# EAGLE design Agit POVera rev 5 (EAGLE 7.2.0)
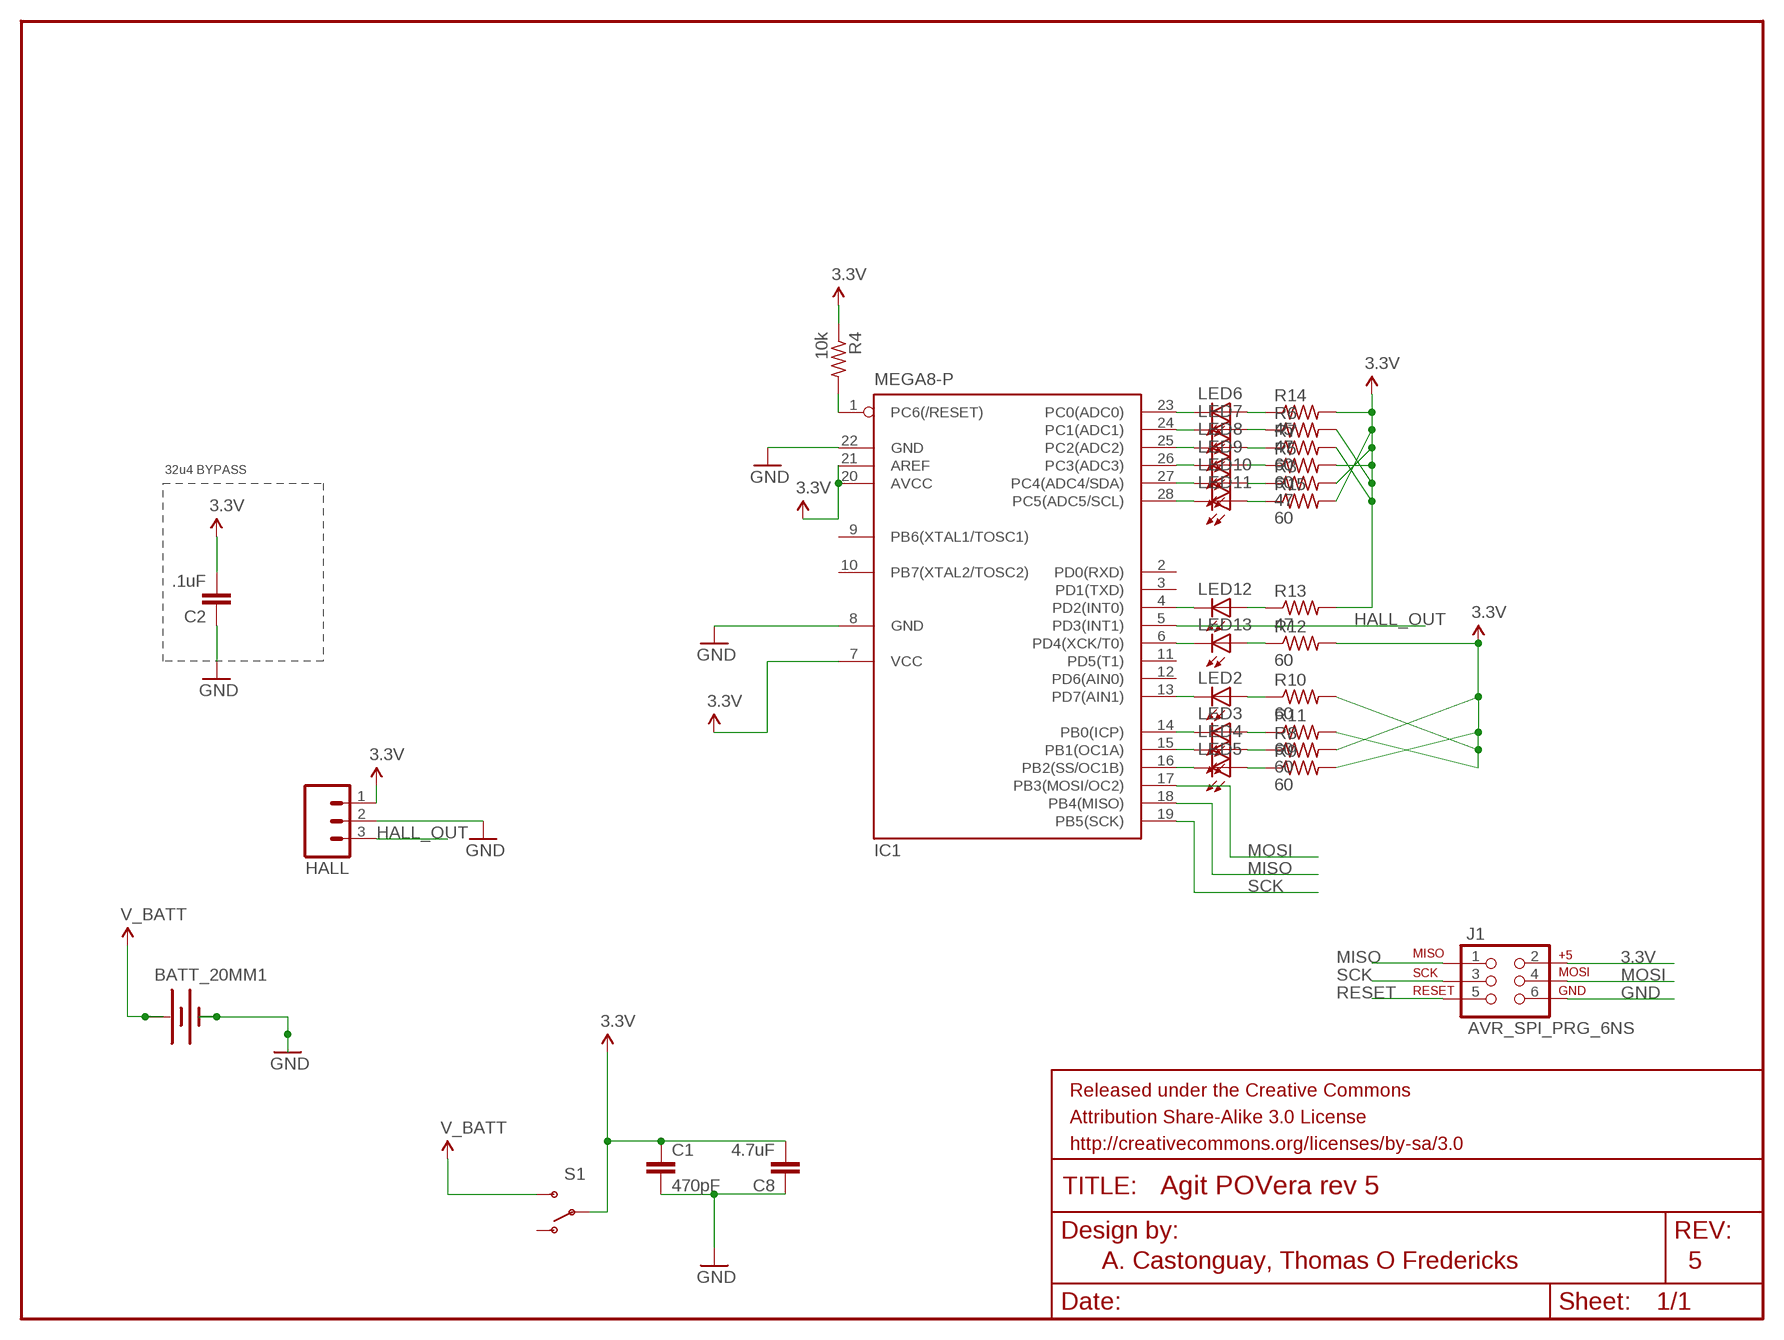
[diagram p0: schematic, sheet 1]

## Parts
BATT_20MM1  BATTERIE  [BATTERIE]
C1  470pF  CAPEZ  [CAP-PTH-SMALLEZ]
C2  .1uF  CAPEZ  [CAP-PTH-SMALLEZ]
C8  4.7uF  CAPEZ  [CAP-PTH-SMALLEZ]
HALL  M03PTH  [1X03]
IC1  MEGA8-P  [DIL28-3]
J1  AVR_SPI_PRG_6NS  [2X3-NS]
LED2  LED5MM  [LED5MM]
LED3  LED5MM  [LED5MM]
LED4  LED5MM  [LED5MM]
LED5  LED5MM  [LED5MM]
LED6  LED5MM  [LED5MM]
LED7  LED5MM  [LED5MM]
LED8  LED5MM  [LED5MM]
LED9  LED5MM  [LED5MM]
LED10  LED5MM  [LED5MM]
LED11  LED5MM  [LED5MM]
LED12  LED5MM  [LED5MM]
LED13  LED5MM  [LED5MM]
R3  47  R-US_0204/7  [0204/7]
R4  10k  R-US_0204/7  [0204/7]
R5  60  R-US_0204/7  [0204/7]
R6  47  R-US_0204/7  [0204/7]
R7  60  R-US_0204/7  [0204/7]
R8  60  R-US_0204/7  [0204/7]
R9  60  R-US_0204/7  [0204/7]
R10  60  R-US_0204/7  [0204/7]
R11  60  R-US_0204/7  [0204/7]
R12  60  R-US_0204/7  [0204/7]
R13  47  R-US_0204/7  [0204/7]
R14  45  R-US_0204/7  [0204/7]
R15  60  R-US_0204/7  [0204/7]
S1  SWITCH-SPDTPTH  [SWITCH-SPDT]

## Nets
3.3V: C1.1 C2.2 C8.2 HALL.1 IC1.7(VCC) IC1.20(AVCC) IC1.21(AREF) J1.2 R3.2 R4.1 R5.2 R6.2 R7.2 R8.2 R9.2 R10.2 R11.2 R12.2 R13.2 R14.2 R15.2 S1.2(P)
GND: BATT_20MM1.2(-) C1.2 C2.1 C8.1 HALL.2 IC1.8(GND) IC1.22(GND) J1.6
HALL_OUT: HALL.3 IC1.5(PD3(INT1))
LED2: IC1.13(PD7(AIN1)) LED2.K(C)
LED3: IC1.14(PB0(ICP)) LED3.K(C)
LED4: IC1.15(PB1(OC1A)) LED4.K(C)
LED5: IC1.16(PB2(SS/OC1B)) LED5.K(C)
LED6: IC1.23(PC0(ADC0)) LED6.K(C)
LED7: IC1.24(PC1(ADC1)) LED7.K(C)
LED8: IC1.25(PC2(ADC2)) LED8.K(C)
LED9: IC1.26(PC3(ADC3)) LED9.K(C)
LED10: IC1.27(PC4(ADC4/SDA)) LED10.K(C)
LED11: IC1.28(PC5(ADC5/SCL)) LED11.K(C)
LED12: IC1.4(PD2(INT0)) LED12.K(C)
LED13: IC1.6(PD4(XCK/T0)) LED13.K(C)
MISO: IC1.18(PB4(MISO)) J1.1
MOSI: IC1.17(PB3(MOSI/OC2)) J1.4
N$14: LED7.A R6.1
N$15: LED12.A R13.1
N$16: LED13.A R12.1
N$17: LED3.A R11.1
N$18: LED2.A R10.1
N$19: LED5.A R9.1
N$20: LED4.A R8.1
N$22: LED10.A R3.1
N$23: LED11.A R15.1
N$25: LED6.A R14.1
R7: LED8.A R7.1
R9: LED9.A R5.1
RESET: IC1.1(PC6(/RESET)) J1.5 R4.2
SCK: IC1.19(PB5(SCK)) J1.3
V_BATT: BATT_20MM1.1(+) S1.3(S)
Unconnected: IC1.2(PD0(RXD)) IC1.3(PD1(TXD)) IC1.9(PB6(XTAL1/TOSC1)) IC1.10(PB7(XTAL2/TOSC2)) IC1.11(PD5(T1)) IC1.12(PD6(AIN0)) S1.1(O)

## Notes on the sheet
- 32u4 BYPASS
- A. Castonguay, Thomas O Fredericks | 5

## Library data of the parts
BATT_20MM1 = User-Submitted:BATTERIE
C1 = SparkFun-Passives:CAP: Capacitor Standard 0603 ceramic capacitor, and 0.1" leaded capacitor.; PROD_ID: CAP-07884
C2 = SparkFun-Passives:CAP: Capacitor Standard 0603 ceramic capacitor, and 0.1" leaded capacitor.; PROD_ID: CAP-00810
C8 = SparkFun-Passives:CAP: Capacitor Standard 0603 ceramic capacitor, and 0.1" leaded capacitor.; PROD_ID: CAP-10300
HALL = SparkFun-Connectors:M03: Header 3 Standard 3-pin 0.1" header. Use with straight break away headers (SKU : PRT-00116), right angle break away headers (PRT-00553), swiss pins (PRT-00743), machine pins (PRT-00117), and female headers (PRT-00115). Molex polarized connector foot print use with SKU : PRT-08232 with associated crimp pins and housings.
IC1 = atmel:MEGA8-P: MICROCONTROLLER 8 Kbytes FLASH, 1 kbytes SRAM, 512 bytes EEPROM, USART, 4-channel 10 bit ADC, 2-channel 8 bit ADC Pin compatible with Atmega48, ATMega88, ATMega168 Source: avr.lbr; OC_FARNELL: unknown; OC_NEWARK: unknown
J1 = SparkFun-Connectors:AVR_SPI_PRG_6: AVR ISP 6 Pin This is the reduced ISP connector for AVR programming. Common on Arduino. This footprint will take up less PCB space and can be used with a 10-pin to 6-pin adapter such as SKU: BOB-08508
LED2-LED13 = SparkFun-LED:LED: LEDs Standard schematic elements and footprints for 5mm, 3mm, 1206, and 0603 sized LEDs. 5mm - Spark Fun Electronics SKU : COM-00529 (and others)
R3-R15 = resistor:R-US_: RESISTOR, American symbol; PROD_ID: RES-00824
S1 = SparkFun-Electromechanical:SWITCH-SPDT: SPDT Switch Simple slide switch, Spark Fun Electronics SKU : COM-00102 DPDT SMT slide switch, AYZ0202, SWCH-08179

## Board
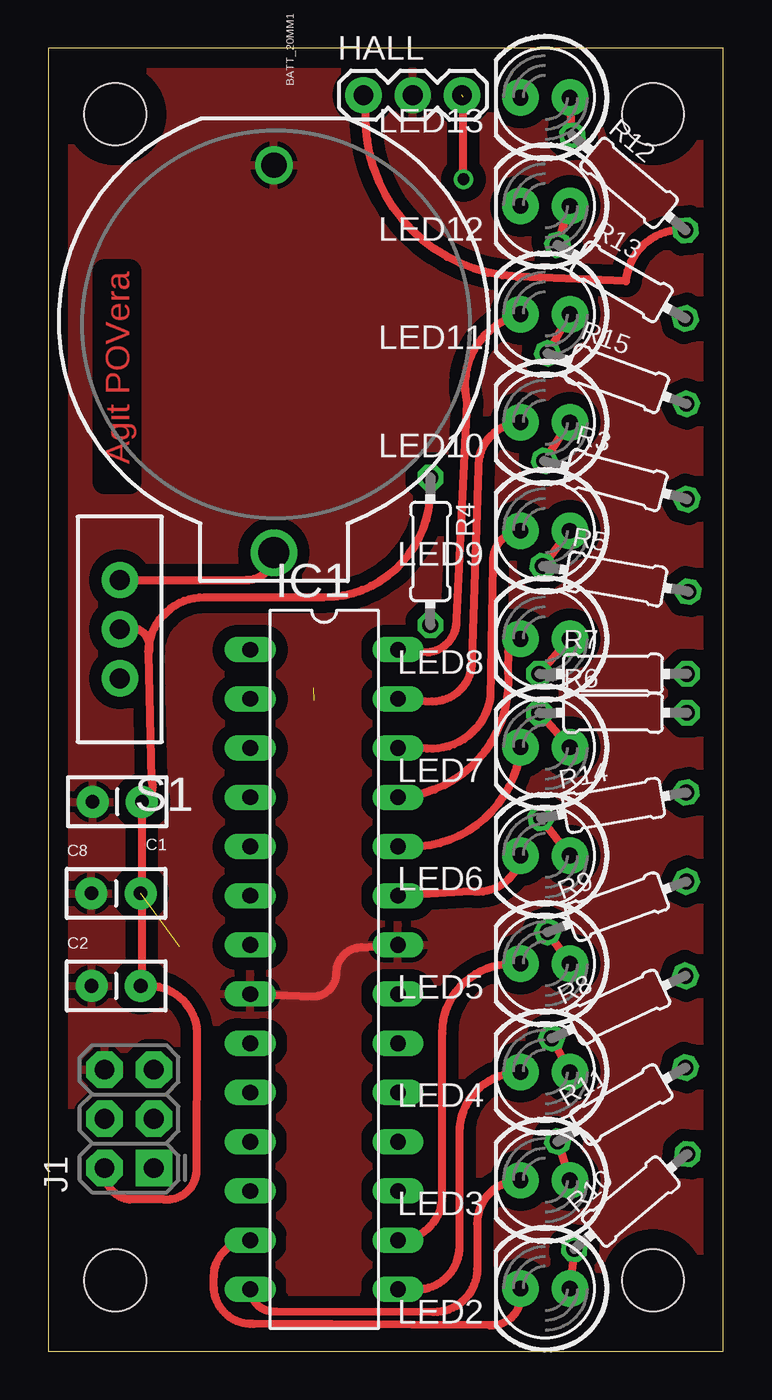
[diagram p1: board, top side]
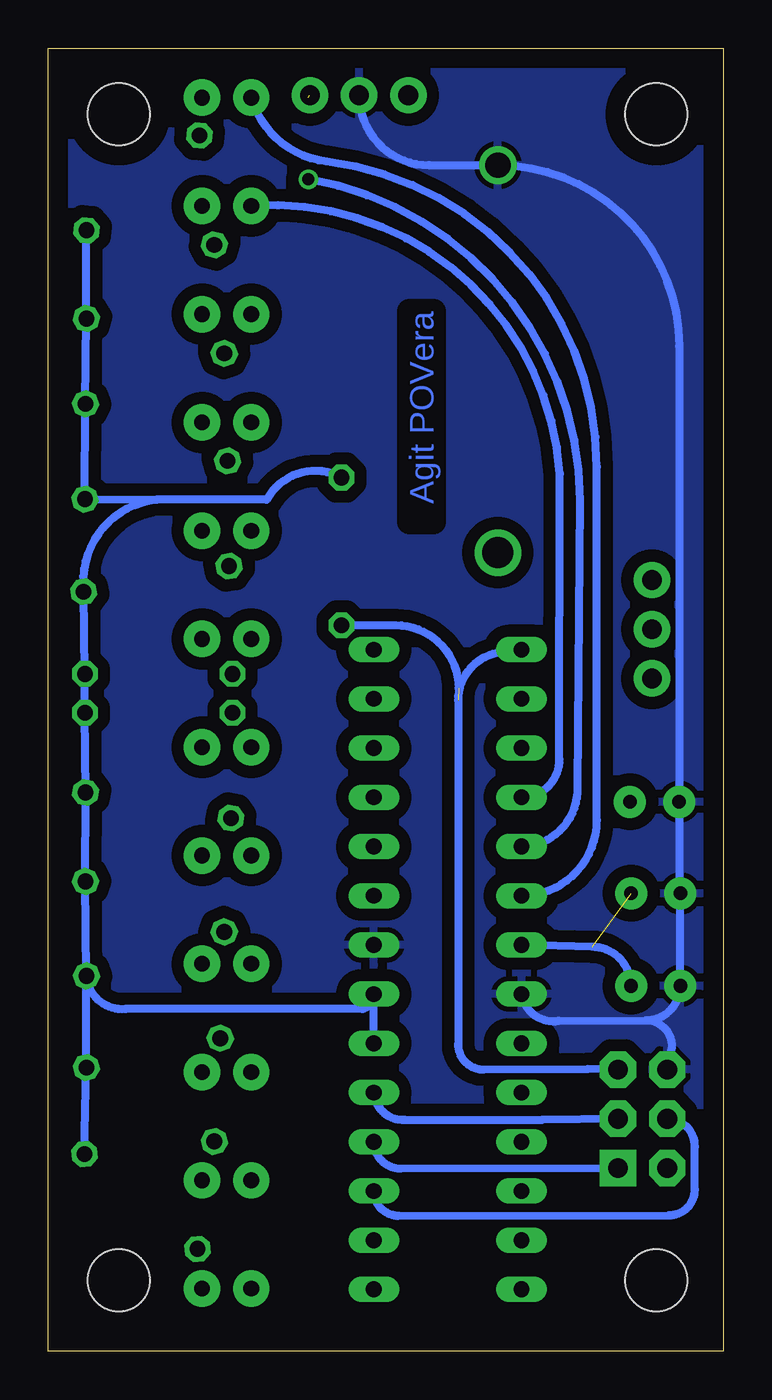
[diagram p2: board, bottom side, seen from below]

Size 34.82 x 67.23 mm. Coordinates in mm from the lower left corner, seen from the top.
Outline: 0,0 34.82,0 34.82,67.23 0,67.23 0,0
Copper layers (1*16): Top 0.035mm / dielectric 1.5mm / Bottom 0.035mm
Design rules "default *": minimum track width 16mil, minimum drill 24mil, track to track 8mil, track to pad 8mil, pad to pad 8mil, via to via 8mil, smd to smd 8mil, copper to edge 40mil, drill to drill 8mil, minimum pad ring 10mil, minimum via ring 8mil, stop-mask expansion 4mil, vias tented up to drill 0mil, thermal gap 10mil
Holes 3.2 mm at 3.45,63.83 31.19,63.83 3.45,3.66 31.19,3.66

### Footprints (pad centres in the part's own frame; a part is rotated, then mirrored left to right if it is on the bottom)
BATTERIE = drill 1.6: 1 11.85,0 | drill 1.3: 2 -8.15,0
CAP-PTH-SMALLEZ = drill 0.7 pad 1.651: 1 0,0; 2 2.54,0
1X03 = drill 1.016 pad 1.88: 1 0,0; 2 2.54,0; 3 5.08,0
DIL28-3 = drill 0.813 long: 1 -16.51,-3.81; 2 -13.97,-3.81; 3 -11.43,-3.81; 4 -8.89,-3.81; 5 -6.35,-3.81; 6 -3.81,-3.81; 7 -1.27,-3.81; 8 1.27,-3.81; 9 3.81,-3.81; 10 6.35,-3.81; 11 8.89,-3.81; 12 11.43,-3.81; 13 13.97,-3.81; 14 16.51,-3.81; 15 16.51,3.81; 16 13.97,3.81; 17 11.43,3.81; 18 8.89,3.81; 19 6.35,3.81; 20 3.81,3.81; 21 1.27,3.81; 22 -1.27,3.81; 23 -3.81,3.81; 24 -6.35,3.81; 25 -8.89,3.81; 26 -11.43,3.81; 27 -13.97,3.81; 28 -16.51,3.81
2X3-NS = drill 1.016 pad 1.88 square: 1 -2.54,-1.27 | drill 1.016 pad 1.88 octagon: 2 -2.54,1.27; 3 0,-1.27; 4 0,1.27; 5 2.54,-1.27; 6 2.54,1.27
LED5MM = drill 0.813 pad 1.88: A -1.27,0; K 1.27,0
0204/7 = drill 0.813 octagon: 1 -3.81,0; 2 3.81,0
SWITCH-SPDT = drill 1.016 pad 1.88: 1 0,2.54; 2 0,0; 3 0,-2.54

### Placement (x,y rotation side)
BATT_20MM1  11.63,53.06 270 top
C1  4.82,28.35 180 top
C2  2.22,18.85 0 top
C8  2.22,23.63 0 top
HALL  16.26,64.82 0 top
IC1  14.22,19.69 270 top
J1  4.17,11.99 90 top
LED2  25.63,3.23 180 top
LED3  25.63,8.81 180 top
LED4  25.63,14.4 180 top
LED5  25.63,19.99 180 top
LED6  25.63,25.58 180 top
LED7  25.63,31.17 180 top
LED8  25.63,36.75 180 top
LED9  25.63,42.34 180 top
LED10  25.63,47.93 180 top
LED11  25.63,53.52 180 top
LED12  25.63,59.11 180 top
LED13  25.63,64.69 180 top
R3  29.26,44.96 345 top
R4  19.7,41.27 270 top
R5  29.26,39.85 350 top
R6  29.13,32.94 0 top
R7  29.13,34.95 0 top
R8  29.41,17.75 25 top
R9  29.34,22.94 20 top
R10  30.05,7.72 40 top
R11  29.57,12.73 30 top
R12  29.95,60.3 320 top
R13  29.57,55.19 330 top
R14  29.16,28.17 10 top
R15  29.34,50.19 340 top
S1  3.68,37.26 180 top

### Tracks (layer width: path | path; a pad name or v marks a point on that pad's centre or on a via)
3.3V  (1 unrouted)
  Top 0.406: R12.2 arc90 29.79,55.22 24.18,55.45 arc-90 16.38,64.03 HALL.1 | J1.2 arc90 4.19,7.82 5.97,7.82 arc90 7.62,9.17 7.64,16.68 arc90 C2.2 arc90 4.82,18.9 C1.1 arc90 5.31,29.48 5.16,36.02 | S1.2 4.55,37.28 arc-90 5.16,36.02 | 5.16,36.02 arc-90 8.05,38.91 14.2,38.91 arc90 19.7,44.42 R4.1
  Bottom 0.406: IC1.20 IC1.21 arc70 18.61,17.65 30.86,17.65 arc90 R8.2 | R4.1 arc-90 23.56,43.94 29.26,43.94 | 29.26,43.94 arc-90 R5.2 R7.2 R6.2 R14.2 R9.2 R8.2 | C2.2 arc-90 6.78,20.86 IC1.7 | R10.2 R11.2 R8.2 | 29.26,43.94 R3.2 R15.2 R13.2 R12.2
GND
  Top 0.406: IC1.8 13.62,18.3 arc90 14.86,19.53 arc-90 16.16,20.84 IC1.22
  Bottom 0.406: IC1.8 arc-90 8.5,17.04 4,17.07 | 4,17.07 arc-90 C2.1 2.22,23.62 arc90 C8.1 arc90 2.28,23.69 C1.2 2.28,51.86 arc-90 BATT_20MM1.2 15.19,61.21 arc90 HALL.2 | J1.6 2.64,15.71 arc-90 4,17.07
  pour Bottom (isolate 0.635): 0.46,66.8 34.39,66.85 34.44,0.3 0.3,0.2
  pour Top (isolate 0.635): 0.48,66.78 34.32,66.8 34.47,0.3 0.3,0.25
  pour Top: 15.93,37.16 15.93,3.1 12.47,3.1 12.62,37.11 12.62,37.03
HALL_OUT  (via drill 0.61)  (1 unrouted)
  Top 0.406: v21.41,60.48 21.41,64.72
  Bottom 0.406: IC1.5 arc-90 7.52,29.09 7.39,43.89 arc-80 v21.41,60.48
LED2
  Top 0.406: LED2.K 24.36,2.77 arc-90 22.78,1.32 10.59,1.4 arc-90 8.53,3.25 8.53,3.84 arc-90 IC1.13
LED3
  Top 0.406: LED3.K arc90 22.12,6.58 22.12,4.24 arc-90 19.86,2.01 11.74,2.03 arc-90 IC1.14
LED4
  Top 0.406: IC1.15 19.01,3.18 arc90 21.21,5.38 21.21,11.25 arc-90 LED4.K
LED5
  Top 0.406: IC1.16 arc90 20.32,8.01 20.32,16.41 arc-90 23.9,19.99 LED5.K
LED6
  Top 0.406: LED6.K arc-90 21.8,23.73 IC1.23
LED7
  Top 0.406: LED7.K arc-90 18.12,26.04 IC1.24
LED8
  Top 0.406: LED8.K arc90 23.72,36.02 23.7,35.18 arc-90 18.3,28.58 IC1.25
LED9
  Top 0.406: LED9.K arc90 22.94,40.64 22.78,33.68 arc-90 19.26,31.12 IC1.26
LED10
  Top 0.406: IC1.27 19.79,33.54 arc90 21.87,35.61 22.2,45.57 arc-90 LED10.K
LED11
  Top 0.406: IC1.28 19.57,36.08 arc90 21.06,37.8 21.61,48.95 arc-90 LED11.K
LED12
  Bottom 0.406: IC1.4 arc-90 8.46,30.54 8.43,45.29 arc-90 LED12.K
LED13
  Bottom 0.406: IC1.6 arc-90 6.53,27.39 6.53,45.64 arc-83 20.47,61.39 arc67 LED13.K
MISO
  Bottom 0.406: IC1.18 arc-90 16.66,9.42 J1.1
MOSI
  Bottom 0.406: IC1.17 arc-90 16.76,6.99 2.79,7.01 arc-90 1.47,8.33 1.47,10.57 arc-90 J1.4
N$14
  Top 0.406: R6.1 LED7.A
N$15
  Top 0.406: R13.1 LED12.A
N$16
  Top 0.406: R12.1 LED13.A
N$17
  Top 0.406: R11.1 LED3.A
N$18
  Top 0.406: R10.1 LED2.A
N$19
  Top 0.406: R9.1 LED5.A
N$20
  Top 0.406: R8.1 LED4.A
N$22
  Top 0.406: R3.1 LED10.A
N$23
  Top 0.406: R15.1 LED11.A
N$25
  Top 0.406: R14.1 LED6.A
R7
  Top 0.406: R7.1 LED8.A
R9
  Top 0.406: R5.1 LED9.A
RESET  (1 unrouted)
  Bottom 0.406: IC1.1 11.19,36.08 arc-90 13.69,33.58 13.69,15.85 arc-90 12.37,14.53 7.01,14.55 J1.5 | R4.2 16.92,37.47 arc90 13.66,34.21
SCK
  Bottom 0.406: IC1.19 arc-90 16.45,11.94 9.32,11.94 J1.3
V_BATT
  Top 0.406: S1.3 10.22,39.8 arc90 BATT_20MM1.1

### Text on the board
Top: Agit POVera
Bottom: Agit POVera
201bmp: /Users/alx/Desktop/AgitPOV_Coyote_master/circuit/coyote 1/logos_coyote_1.bmp